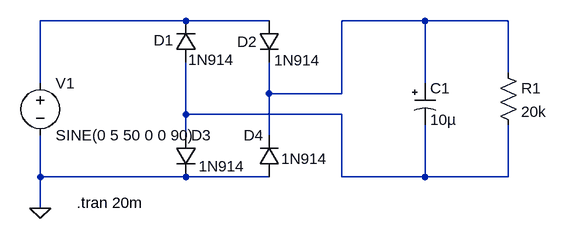
[diagram p0: schematic lab2_2-napiv_period_vipramlach.asc]
lab2_2-napiv_period_vipramlach.asc, the LTspice schematic file:
Version 4
SHEET 1 880 680
WIRE 240 32 16 32
WIRE 368 32 240 32
WIRE 608 32 480 32
WIRE 736 32 608 32
WIRE 736 112 736 32
WIRE 16 128 16 32
WIRE 608 128 608 32
WIRE 368 144 368 96
WIRE 480 144 480 32
WIRE 480 144 368 144
WIRE 240 176 240 96
WIRE 480 176 240 176
WIRE 240 208 240 176
WIRE 368 208 368 144
WIRE 16 272 16 208
WIRE 240 272 16 272
WIRE 368 272 240 272
WIRE 480 272 480 176
WIRE 608 272 608 192
WIRE 608 272 480 272
WIRE 736 272 736 192
WIRE 736 272 608 272
WIRE 16 320 16 272
FLAG 16 320 0
SYMBOL voltage 16 112 R0
WINDOW 123 0 0 Left 2
WINDOW 39 0 0 Left 2
SYMATTR InstName V1
SYMATTR Value SINE(0 5 50 0 0 90)
SYMBOL diode 256 96 R180
WINDOW 0 35 34 Left 2
WINDOW 3 -59 4 Left 2
SYMATTR InstName D1
SYMATTR Value 1N914
SYMBOL diode 352 32 R0
WINDOW 0 -33 32 Left 2
WINDOW 3 24 61 Left 2
SYMATTR InstName D2
SYMATTR Value 1N914
SYMBOL diode 224 208 R0
WINDOW 3 36 48 Left 2
SYMATTR Value 1N914
SYMATTR InstName D3
SYMBOL diode 384 272 R180
WINDOW 0 24 64 Left 2
WINDOW 3 -74 28 Left 2
SYMATTR InstName D4
SYMATTR Value 1N914
SYMBOL res 720 96 R0
SYMATTR InstName R1
SYMATTR Value 20k
SYMBOL polcap 592 128 R0
SYMATTR InstName C1
SYMATTR Value 10µ
TEXT 72 312 Left 2 !.tran 20m

The netlist it stands for:
* lab2_2-napiv_period_vipramlach.asc
V1 N001 0 SINE(0 5 50 0 0 90)
D1 N003 N001 1N914
D2 N001 N002 1N914
D3 N003 0 1N914
D4 0 N002 1N914
R1 N002 N003 20k
C1 N002 N003 10µ
.model D D
.lib standard.dio
.tran 20m
.backanno
.end